# EAGLE design demuxkd (EAGLE 7.5.0)
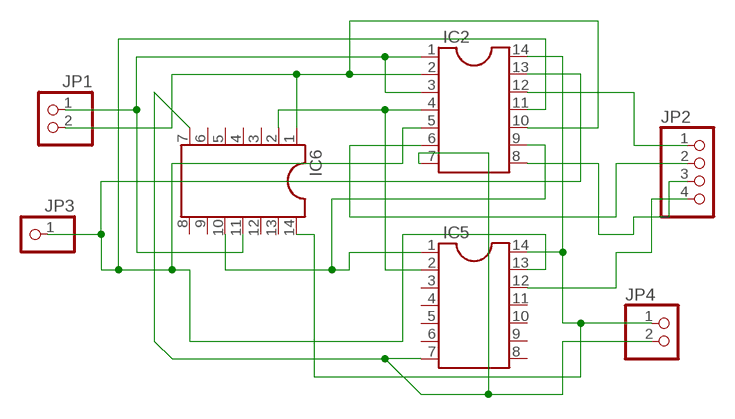
[diagram p0: schematic, sheet 1]

## Parts
IC2  DIL14  [DIL14]
IC5  DIL14  [DIL14]
IC6  DIL14  [DIL14]
JP1  PINHD-1X2  [1X02]
JP2  PINHD-1X4  [1X04]
JP3  PINHD-1X1  [1X01]
JP4  PINHD-1X2  [1X02]

## Nets
N$1: IC2.1 IC2.3 IC6.11 JP1.1
N$2: IC2.9 IC5.1 IC6.10
N$3: IC2.2 IC2.10 IC6.1 JP1.2
N$4: IC2.5 IC2.11 IC2.13 IC5.13 JP3.1
N$5: IC2.4 IC5.2 IC6.2
N$6: IC2.7 IC5.7 IC6.7 JP4.2
N$9: IC2.12 JP2.1
N$10: IC2.6 JP2.2
N$11: IC2.8 JP2.3
N$12: IC5.12 JP2.4
N$16: IC2.14 IC5.14 IC6.14 JP4.1
Unconnected: IC5.3 IC5.4 IC5.5 IC5.6 IC5.8 IC5.9 IC5.10 IC5.11 IC6.3 IC6.4 IC6.5 IC6.6 IC6.8 IC6.9 IC6.12 IC6.13

## Library data of the parts
IC2 IC5 IC6 = ic-package:DIL14: Dual In Line / Socket
JP1 JP4 = pinhead:PINHD-1X2: PIN HEADER
JP2 = pinhead:PINHD-1X4: PIN HEADER
JP3 = pinhead:PINHD-1X1: PIN HEADER

## Net classes
0 default: width 0.4 mm, clearance 0.25 mm

## Board
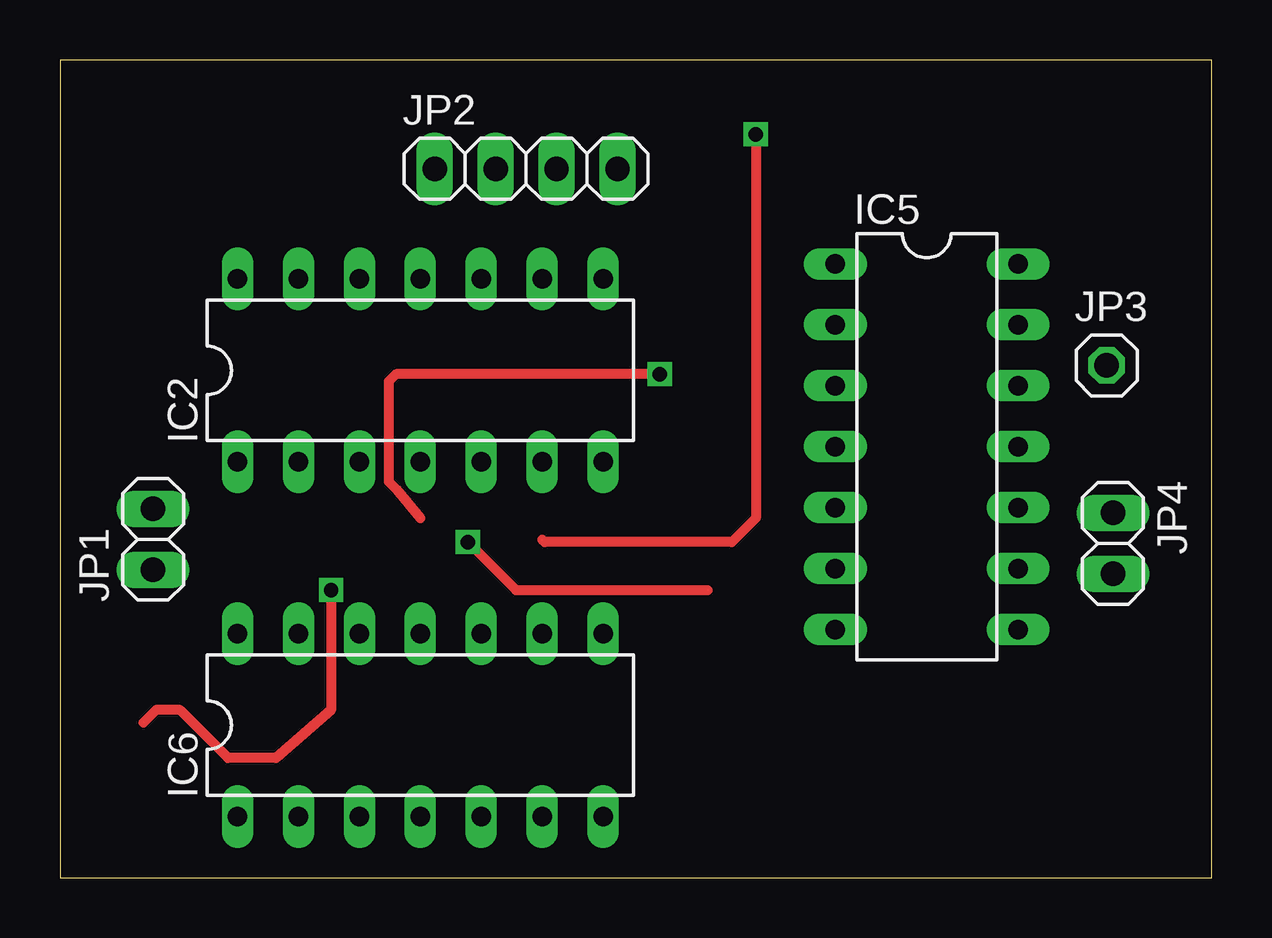
[diagram p1: board, top side]
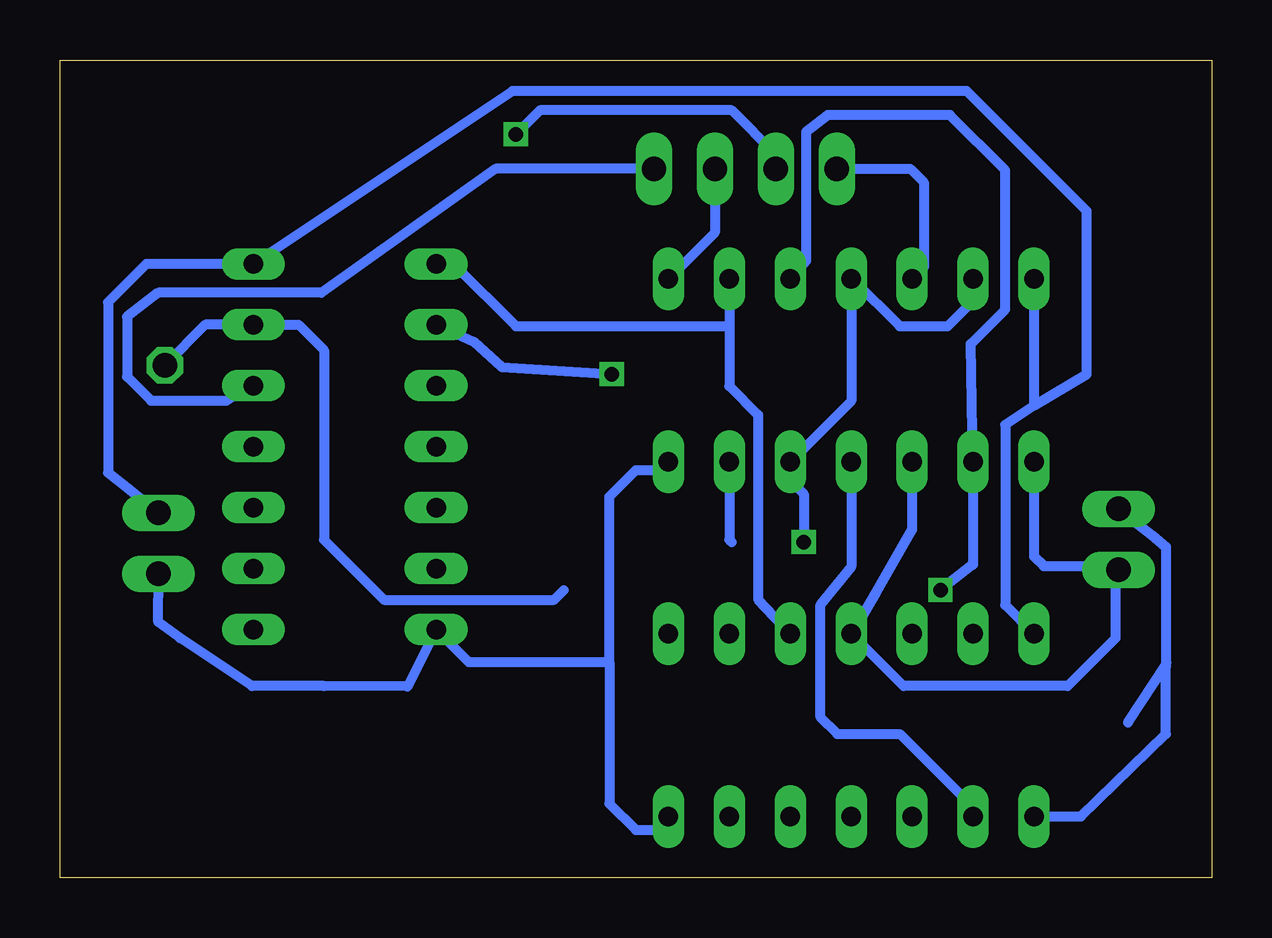
[diagram p2: board, bottom side, seen from below]

Size 48 x 34.1 mm. Coordinates in mm from the lower left corner, seen from the top.
Outline: 0,0 48,0 48,34.1 0,34.1 0,0
Copper layers (1*16): Top 0.035mm / dielectric 1.5mm / Bottom 0.035mm
Design rules "default": minimum track width 10mil, minimum drill 24mil, track to track 8mil, track to pad 8mil, pad to pad 8mil, via to via 8mil, smd to smd 8mil, copper to edge 40mil, drill to drill 8mil, minimum pad ring 10mil, minimum via ring 8mil, stop-mask expansion 4mil, vias tented up to drill 0mil, thermal gap 10mil

### Footprints (pad centres in the part's own frame; a part is rotated, then mirrored left to right if it is on the bottom)
DIL14 = drill 0.813 long: 1 -7.62,-3.81; 2 -5.08,-3.81; 3 -2.54,-3.81; 4 0,-3.81; 5 2.54,-3.81; 6 5.08,-3.81; 7 7.62,-3.81; 8 7.62,3.81; 9 5.08,3.81; 10 2.54,3.81; 11 0,3.81; 12 -2.54,3.81; 13 -5.08,3.81; 14 -7.62,3.81
1X02 = drill 1.016 long: 1 -1.27,0; 2 1.27,0
1X04 = drill 1.016 long: 1 -3.81,0; 2 -1.27,0; 3 1.27,0; 4 3.81,0
1X01 = drill 1.016 octagon: 1 0,0

### Placement (x,y rotation side)
IC2  15.02,21.16 0 top
IC5  36.13,17.98 270 top
IC6  15.02,6.37 0 top
JP1  3.88,14.12 90 top
JP2  19.43,29.56 0 top
JP3  43.63,21.37 0 top
JP4  43.89,13.95 270 top

### Tracks (layer width: path | path; a pad name or v marks a point on that pad's centre or on a via)
N$1
  Bottom 0.406: IC2.3 12.48,14.52 14,11.9 15,10.2 IC6.11 12.84,8 6,8 4,10 4,12.73 JP1.1 4.03,13 7,13 7.4,13.4 IC2.1
N$2
  Bottom 0.406: IC2.9 20.1,23 | 20.1,23 20.1,20.5 18.9,19.3 18.9,11.62 IC6.10 | IC5.1 31.6,25.6 29,23 20.1,23
N$3  (via drill 0.6)  (1 unrouted)
  Top 0.406: v11.3,12 11.3,7 9,5 7,5 5,7 4,7 3.48,6.48
  Bottom 0.406: v11.3,12 9.94,13.06 IC2.2 10.04,22.26 8.6,23.7 8.6,29.5 10.9,31.8 16,31.8 16.9,31.1 16.9,25.73 IC2.10 | JP1.2 2.49,14.29 1.9,13.8 1.9,9.06 1.89,8.93 | 1.89,8.93 3.48,6.48 | IC6.1 5.44,2.56 1.9,6 1.9,8.81 1.89,8.93
N$4  (via drill 0.6)  (1 unrouted)
  Top 0.406: v17,14 19,12 27,12
  Bottom 0.406: JP3.1 41.94,23.06 IC5.13 38.06,23.06 37,22 37,14.1 34.5,11.6 27.4,11.6 27,12 | IC2.13 10,24.91 10,24 11,23 13,23 14.97,24.97 IC2.11 15.02,19.89 IC2.5 17.56,16.56 17,16 v17,14
N$5  (via drill 0.6)  (1 unrouted)
  Top 0.406: v25,21 14,21 13.7,20.7 13.7,16.52 14,16.22 15.02,15
  Bottom 0.406: IC2.4 15.02,12.98 16.3,11.4 16.3,6.7 15.6,6 13,6 10,3 10,2.62 IC6.2 | IC5.2 30.76,22.36 29.6,21.3 v25,21
N$6
  Bottom 0.406: 25.1,8.99 30.95,8.99 IC5.7 33.52,7.98 37,8 40,8 43,10 43.9,10.67 JP4.2 | 25.1,8.99 25.1,3.1 24,2 23.2,2 IC6.7 | 25.1,8.99 25.1,15.9 24,17 22.99,17 IC2.7
N$9
  Bottom 0.406: JP2.1 12.56,29.56 12,29 12,25.45 IC2.12
N$10  (via drill 0.6)  (1 unrouted)
  Top 0.406: v29,31 29,15 28,14 20.2,14 20.1,14.1
  Bottom 0.406: JP2.2 18.16,30.16 20,32 28,32 v29,31 | IC2.6 20.1,14.1 20,14
N$11
  Bottom 0.406: JP2.3 20.7,26.91 IC2.8
N$12
  Bottom 0.406: JP2.4 29.84,29.56 37.1,24.4 43.9,24.4 45.2,23.4 45.2,20.9 44.2,19.9 41.06,19.9 40.76,20.1 IC5.12
N$16
  Bottom 0.406: IC2.14 7.4,19.7 | IC6.14 8.6,11.38 8.6,18.9 7.4,19.7 | 7.4,19.7 5.2,21 5.2,27.8 10.2,32.8 29.14,32.8 IC5.14 44.4,25.6 46,24 46,16.9 45.1,16.2 44.87,16 JP4.1